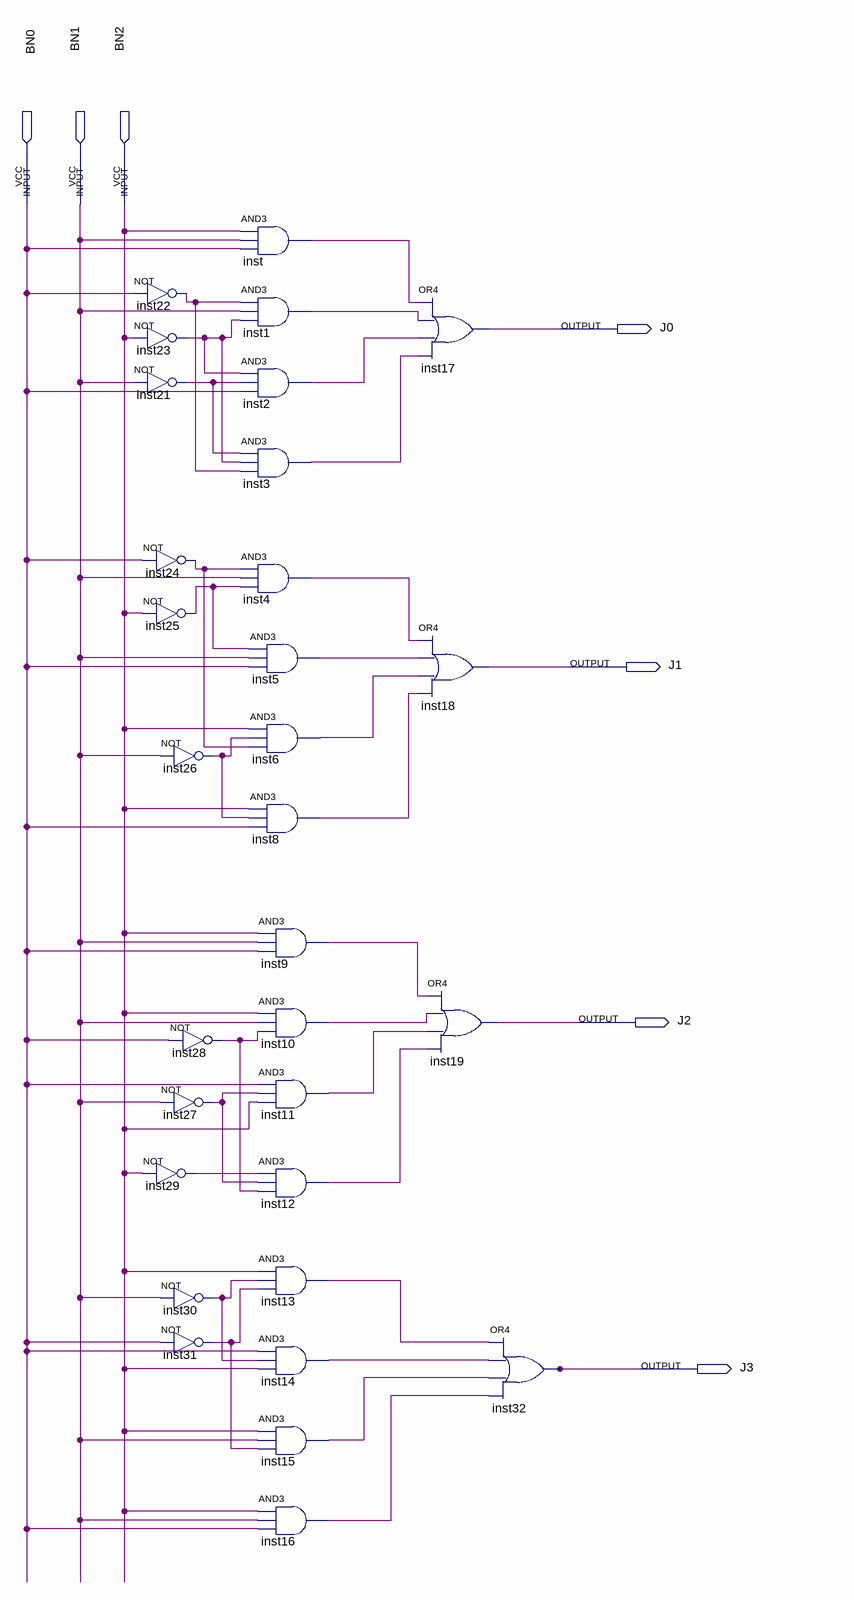
[diagram p0: schematic sheet]
// Quartus schematic Practica101.bdf as structural Verilog: 31 symbols, 7 pins
module Practica101 (
  input  BN0,
  input  BN1,
  input  BN2,
  output J0,
  output J1,
  output J2,
  output J3
);

  wire inst1_out, inst2_out, inst3_out, inst4_out, inst5_out, inst6_out, inst8_out, inst9_out, inst10_out,
       inst11_out, inst12_out, inst13_out, inst14_out, inst15_out, inst16_out, inst21_out, inst22_out,
       inst23_out, inst24_out, inst25_out, inst26_out, inst27_out, inst28_out, inst29_out, inst30_out,
       inst31_out, inst_out;

  not inst22 (inst22_out, BN0);
  not inst23 (inst23_out, BN2);
  not inst21 (inst21_out, BN1);
  not inst24 (inst24_out, BN0);
  not inst25 (inst25_out, BN2);
  not inst26 (inst26_out, BN1);
  not inst28 (inst28_out, BN0);
  not inst27 (inst27_out, BN1);
  not inst29 (inst29_out, BN2);
  not inst30 (inst30_out, BN1);
  not inst31 (inst31_out, BN0);
  and inst (inst_out, BN2, BN1, BN0);
  and inst1 (inst1_out, inst22_out, BN1, inst23_out);
  and inst2 (inst2_out, inst23_out, inst21_out, BN0);
  and inst3 (inst3_out, inst21_out, inst23_out, inst22_out);
  and inst4 (inst4_out, inst24_out, BN1, inst25_out);
  and inst5 (inst5_out, inst25_out, BN1, BN0);
  and inst6 (inst6_out, BN2, inst26_out, inst24_out);
  and inst8 (inst8_out, BN2, inst26_out, BN0);
  and inst9 (inst9_out, BN2, BN1, BN0);
  and inst10 (inst10_out, BN2, BN1, inst28_out);
  and inst11 (inst11_out, BN0, inst27_out, BN2);
  and inst12 (inst12_out, inst29_out, inst27_out, inst28_out);
  and inst13 (inst13_out, BN2, inst30_out, inst31_out);
  and inst14 (inst14_out, BN0, inst30_out, BN2);
  and inst15 (inst15_out, BN2, BN1, inst31_out);
  and inst16 (inst16_out, BN2, BN1, BN0);
  or inst17 (J0, inst_out, inst1_out, inst2_out, inst3_out);
  or inst18 (J1, inst4_out, inst5_out, inst6_out, inst8_out);
  or inst19 (J2, inst9_out, inst10_out, inst11_out, inst12_out);
  or inst32 (J3, inst13_out, inst14_out, inst15_out, inst16_out);
endmodule
